# Altium schematic sheet 06_LMS7002M_RF2.SchDoc: LMS7002M RF
size A3; Organization: Lime Microsystems; Address1: Surrey Tech Centre; Address2: Guildford GU2 7YG; Address3: Surrey; Address4: United Kingdom; Revision: v1.2; SheetNumber: 6; SheetTotal: 16
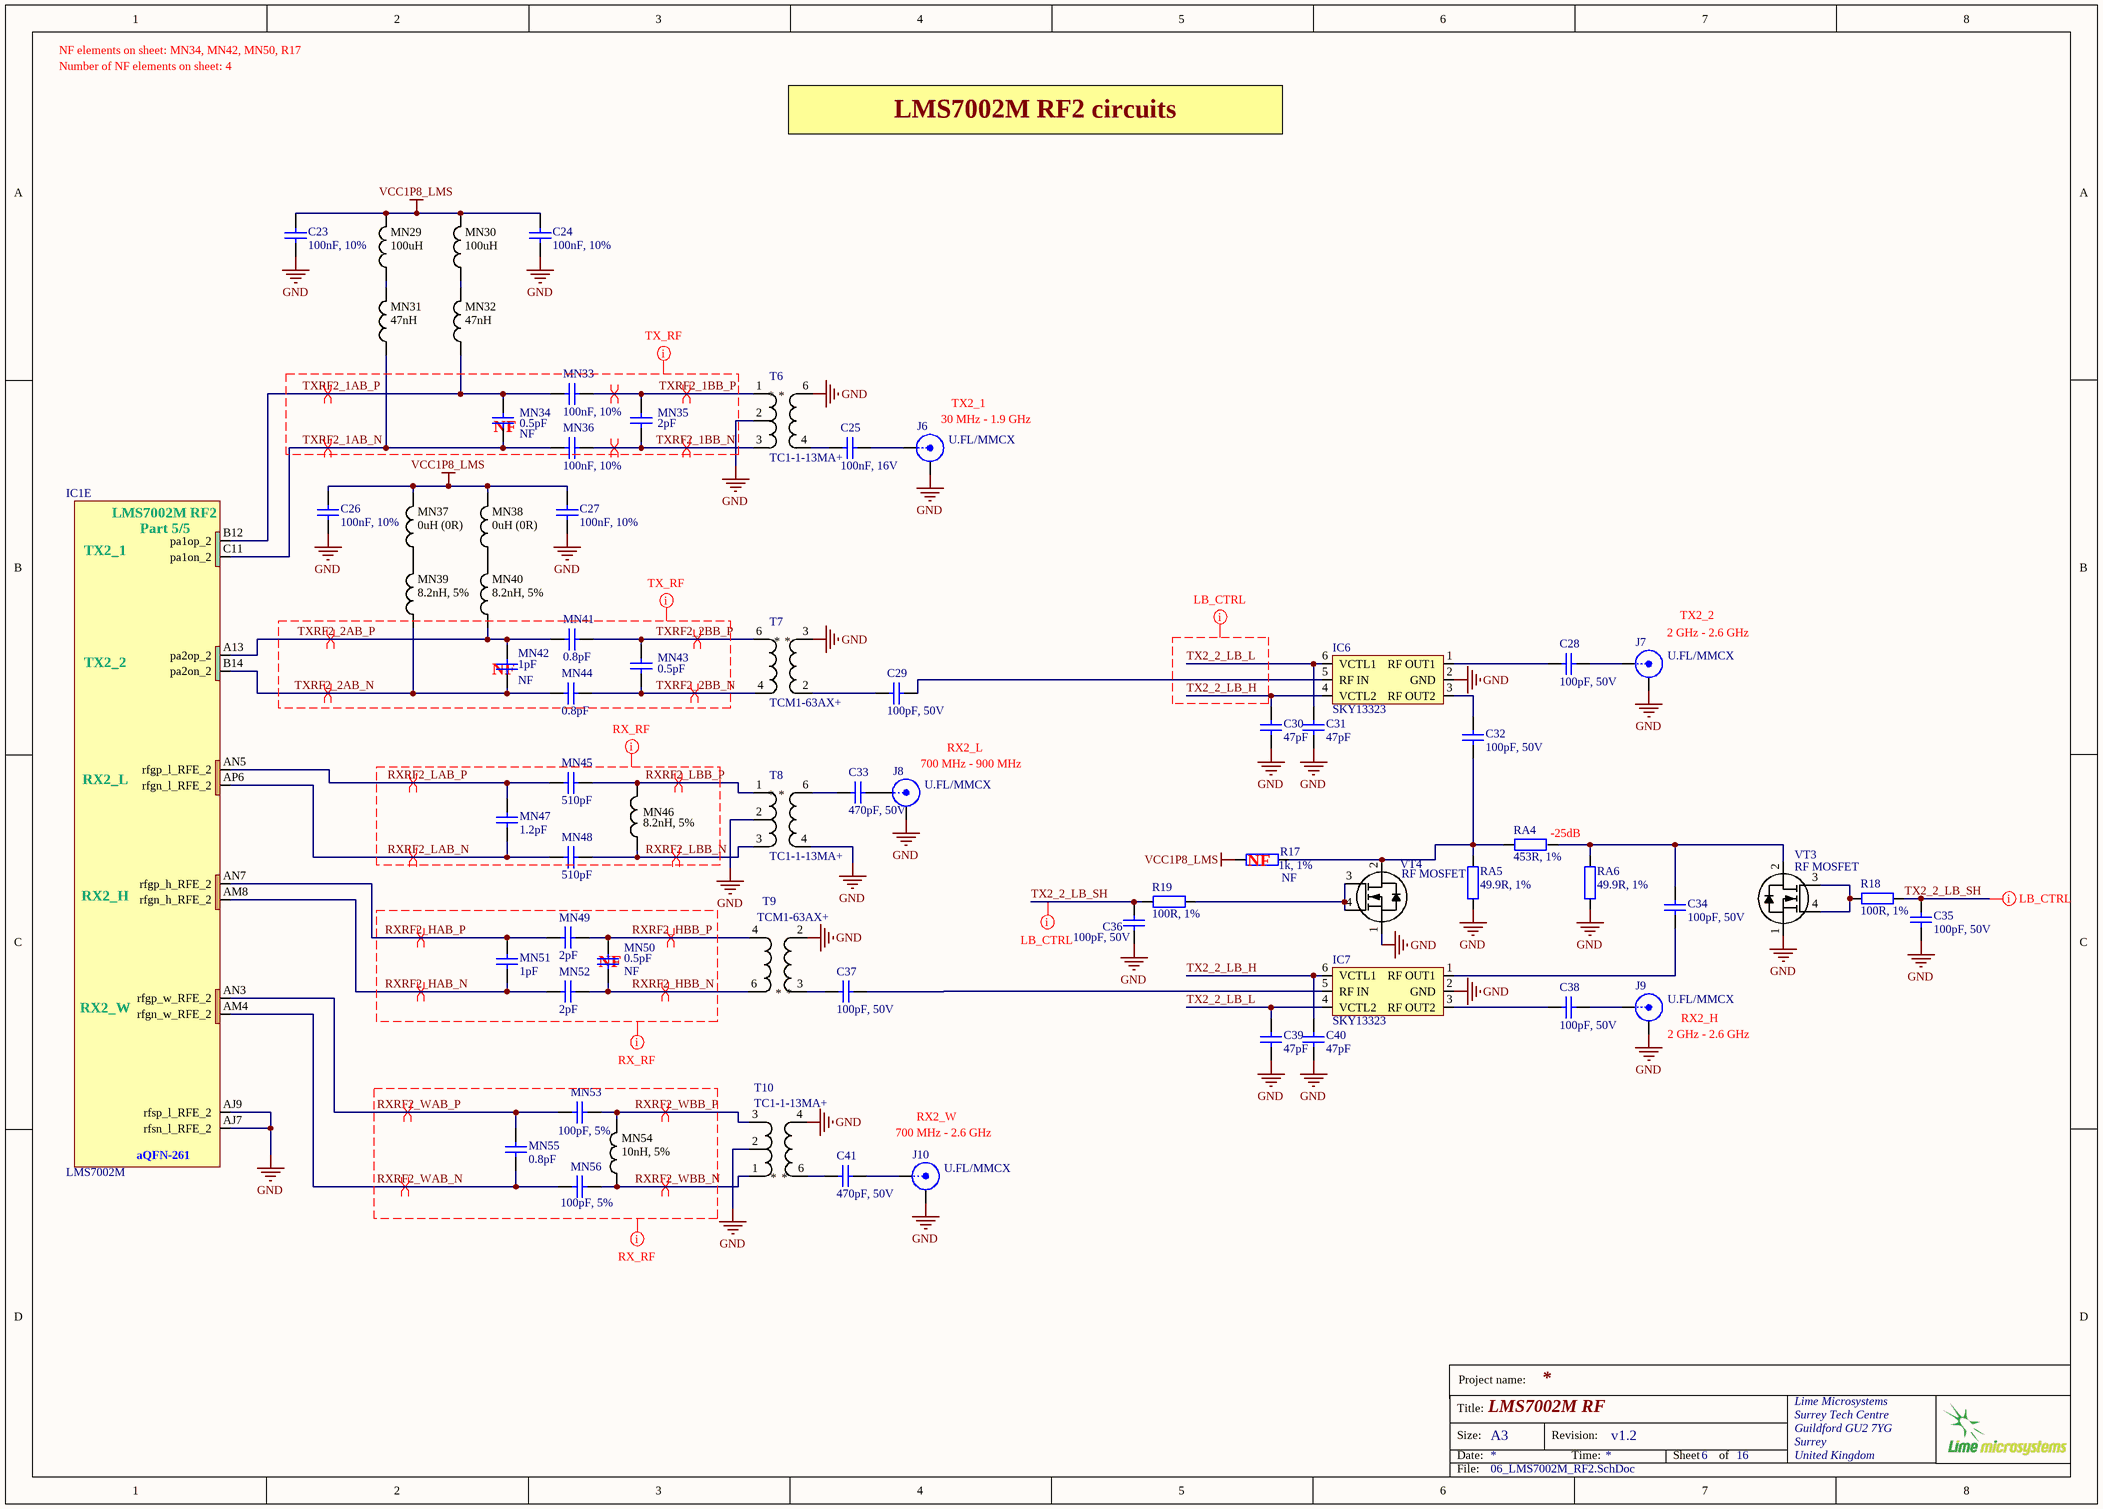
[diagram p0: 06_LMS7002M_RF2.SchDoc]

## Parts
C23  100nF, 10%  [CAP0402]
C24  100nF, 10%  [CAP0402]
C25  100nF, 16V  [CAP0402]
C26  100nF, 10%  [CAP0402]
C27  100nF, 10%  [CAP0402]
C28  100pF, 50V  [CAP0402]
C29  100pF, 50V  [CAP0402]
C30  47pF  [CAP0402]
C31  47pF  [CAP0402]
C32  100pF, 50V  [CAP0402]
C33  470pF, 50V  [CAP0402]
C34  100pF, 50V  [CAP0402]
C35  100pF, 50V  [CAP0402]
C36  100pF, 50V  [CAP0402]
C37  100pF, 50V  [CAP0402]
C38  100pF, 50V  [CAP0402]
C39  47pF  [CAP0402]
C40  47pF  [CAP0402]
C41  470pF, 50V  [CAP0402]
IC1  LMS7002M  [LMS7002M_v2]  (part E of 5)
IC6  SKY13323  [SKY13323-378LF]
IC7  SKY13323  [SKY13323-378LF]
J6  U.FL/MMCX  [MMCX_UFL_conn_u]
J7  U.FL/MMCX  [MMCX_UFL_conn_u]
J8  U.FL/MMCX  [MMCX_UFL_conn_u]
J9  U.FL/MMCX  [MMCX_UFL_conn_u]
J10  U.FL/MMCX  [MMCX_UFL_conn_u]
MN29  100uH  [RES0805]
MN30  100uH  [RES0805]
MN31  47nH  [RES0402]
MN32  47nH  [RES0402]
MN33  100nF, 10%  [CAP0402]
MN34  0.5pF  Assembly Info: NF  [CAP0402]
MN35  2pF  [CAP0402]
MN36  100nF, 10%  [CAP0402]
MN37  0uH (0R)  [RES0805]
MN38  0uH (0R)  [RES0805]
MN39  8.2nH, 5%  [RES0402]
MN40  8.2nH, 5%  [RES0402]
MN41  0.8pF  [CAP0402]
MN42  1pF  Assembly Info: NF  [CAP0402]
MN43  0.5pF  [CAP0402]
MN44  0.8pF  [CAP0402]
MN45  510pF  [CAP0402]
MN46  8.2nH, 5%  [RES0402]
MN47  1.2pF  [CAP0402]
MN48  510pF  [CAP0402]
MN49  2pF  [CAP0402]
MN50  0.5pF  Assembly Info: NF  [CAP0402]
MN51  1pF  [CAP0402]
MN52  2pF  [CAP0402]
MN53  100pF, 5%  [CAP0402]
MN54  10nH, 5%  [RES0402]
MN55  0.8pF  [CAP0402]
MN56  100pF, 5%  [CAP0402]
R17  1k, 1%  Assembly Info: NF  [RES0402]
R18  100R, 1%  [RES0402]
R19  100R, 1%  [RES0402]
RA4  453R, 1%  [RES0402]
RA5  49.9R, 1%  [RES0402]
RA6  49.9R, 1%  [RES0402]
T6  TC1-1-13MA+  [TC1-1-13MA+_v2]
T7  TCM1-63AX+  [TCM1-63AX+_v2]
T8  TC1-1-13MA+  [TC1-1-13MA+_v2]
T9  TCM1-63AX+  [TCM1-63AX+_v2]
T10  TC1-1-13MA+  [TC1-1-13MA+_v2]
VT3  RF MOSFET  [BF1105R_SOT143R4]
VT4  RF MOSFET  [BF1105R_SOT143R4]

## Nets
GND: C23.1 C24.1 C26.1 C27.1 C30.1 C31.1 C35.2 C36.2 C39.1 C40.1 IC1.AJ7(rfsn_l_RFE_2) IC1.AJ9(rfsp_l_RFE_2) IC6.2(GND) IC7.2(GND) J6.2(Y) J7.2(Y) J8.2(Y) J9.2(Y) J10.2(Y) RA5.1 RA6.1 T6.2 T6.6 T7.3 T8.2 T8.4 T9.2 T10.2 T10.4 VT3.1(S) VT4.1(S)
VCC1P8_LMS: C23.2 C24.2 C26.2 C27.2 MN29.2 MN30.2 MN37.2 MN38.2 R17.2
RXRF2_HAB_N: IC1.AM8(rfgn_h_RFE_2) MN51.1 MN52.2
RXRF2_HAB_P: IC1.AN7(rfgp_h_RFE_2) MN49.2 MN51.2
RXRF2_HBB_N: MN50.1 MN52.1 T9.6
RXRF2_HBB_P: MN49.1 MN50.2 T9.4
RXRF2_LAB_N: IC1.AP6(rfgn_l_RFE_2) MN47.1 MN48.2
RXRF2_LAB_P: IC1.AN5(rfgp_l_RFE_2) MN45.2 MN47.2
RXRF2_LBB_N: MN46.1 MN48.1 T8.3
RXRF2_LBB_P: MN45.1 MN46.2 T8.1
RXRF2_WAB_N: IC1.AM4(rfgn_w_RFE_2) MN55.2 MN56.2
RXRF2_WAB_P: IC1.AN3(rfgp_w_RFE_2) MN53.2 MN55.1
RXRF2_WBB_N: MN54.1 MN56.1 T10.1
RXRF2_WBB_P: MN53.1 MN54.2 T10.3
TX2_2_LB_H: C30.2 C40.2 IC6.4(VCTL2) IC7.6(VCTL1)
TX2_2_LB_L: C31.2 C39.2 IC6.6(VCTL1) IC7.4(VCTL2)
TX2_2_LB_SH: C35.1 C36.1 R18.1 R19.2
TXRF2_1AB_N: IC1.C11(pa1on_2) MN31.1 MN34.1 MN36.1
TXRF2_1AB_P: IC1.B12(pa1op_2) MN32.1 MN33.2 MN34.2
TXRF2_1BB_N: MN35.1 MN36.2 T6.3
TXRF2_1BB_P: MN33.1 MN35.2 T6.1
TXRF2_2AB_N: IC1.B14(pa2on_2) MN39.1 MN42.2 MN44.2
TXRF2_2AB_P: IC1.A13(pa2op_2) MN40.1 MN41.2 MN42.1
TXRF2_2BB_N: MN43.1 MN44.1 T7.4
TXRF2_2BB_P: MN41.1 MN43.2 T7.6
NetC25_1: C25.1 J6.1(X)
NetC25_2: C25.2 T6.4
NetC28_1: C28.1 J7.1(X)
NetC28_2: C28.2 IC6.1(RF_OUT1)
NetC29_1: C29.1 IC6.5(RF_IN)
NetC29_2: C29.2 T7.2
NetC32_1: C32.1 IC6.3(RF_OUT2)
NetC32_2: C32.2 R17.1 RA4.1 RA5.2 VT4.2(D)
NetC33_1: C33.1 J8.1(X)
NetC33_2: C33.2 T8.6
NetC34_1: C34.1 RA4.2 RA6.2 VT3.2(D)
NetC34_2: C34.2 IC7.1(RF_OUT1)
NetC37_1: C37.1 IC7.5(RF_IN)
NetC37_2: C37.2 T9.3
NetC38_1: C38.1 J9.1(X)
NetC38_2: C38.2 IC7.3(RF_OUT2)
NetC41_1: C41.1 J10.1(X)
NetC41_2: C41.2 T10.6
NetMN29_1: MN29.1 MN31.2
NetMN30_1: MN30.1 MN32.2
NetMN37_1: MN37.1 MN39.2
NetMN38_1: MN38.1 MN40.2
NetR18_2: R18.2 VT3.3(G2) VT3.4(G1)
NetR19_1: R19.1 VT4.3(G2) VT4.4(G1)

## Layout directives
differential pair: RXRF2_HAB_N, RXRF2_HAB_P, RXRF2_HBB_N, RXRF2_HBB_P, RXRF2_LAB_N, RXRF2_LAB_P, RXRF2_LBB_N, RXRF2_LBB_P, RXRF2_WAB_N, RXRF2_WAB_P, RXRF2_WBB_N, RXRF2_WBB_P, TXRF2_1AB_N, TXRF2_1AB_P, TXRF2_1BB_N, TXRF2_1BB_P, TXRF2_2AB_N, TXRF2_2AB_P, TXRF2_2BB_N, TXRF2_2BB_P
net class TX_RF: TXRF2_1AB_N, TXRF2_1AB_P, TXRF2_1BB_N, TXRF2_1BB_P, TXRF2_2AB_N, TXRF2_2AB_P, TXRF2_2BB_N, TXRF2_2BB_P
net class RX_RF: RXRF2_HAB_N, RXRF2_HAB_P, RXRF2_HBB_N, RXRF2_HBB_P, RXRF2_LAB_N, RXRF2_LAB_P, RXRF2_LBB_N, RXRF2_LBB_P, RXRF2_WAB_N, RXRF2_WAB_P, RXRF2_WBB_N, RXRF2_WBB_P
net class LB_CTRL: TX2_2_LB_H, TX2_2_LB_L, TX2_2_LB_SH

## Notes on the sheet
- Number of NF elements on sheet: 4
- NF elements on sheet: MN34, MN42, MN50, R17
- LMS7002M RF2 circuits
- (near MN34) NF
- (near J6) 30 MHz - 1.9 GHz
- (near J6) TX2_1
- (near J7) 2 GHz - 2.6 GHz
- (near J7) TX2_2
- (near MN42) NF
- (near J8) 700 MHz - 900 MHz
- RX2_L
- (near RA4) -25dB
- (near R17) NF
- (near MN50) NF
- (near J9) 2 GHz - 2.6 GHz
- (near J9) RX2_H
- (near J10) RX2_W
- 700 MHz - 2.6 GHz
- Project name:
- Title:
- Size:
- Date:
- A3
- Revision:
- Time:
- Sheet
- of
- File:
- (in symbol LMS7002M, part E) LMS7002M RF2; Part 5/5; TX2_1; TX2_2; RX2_L; RX2_H; RX2_W; aQFN-261

## Library data of the parts
C23 C24 C26 C27 = Cap_0402: Manufacturer: Murata Electronics; Manufacturer Part Number: GRM155R71C104KA88D; Part Description: 0.10µF ±10% 16V X7R Ceramic Capacitor -55°C ~ 125°C Surface Mount, MLCC 0402 (1005 Metric) 0.039" L x 0.020" W (1.00mm x 0.50mm); Voltage Rating DC: 16 V; Type: General Purpose MLCC; Capacitance: 0.1 uF; Case Length: 1 mm; Dielectric: X7R; Case Height: 0.5 mm; Temperature Coefficient / Code: +/- 15 %; Value: 100nF, 10%; Supplier 1: Mouser; Supplier Part Number 1: 81-GRM155R71C104KA88; Case Code - in: 0402; RoHS: RoHS Compliant; Operating Temperature Range: - 55 C to + 125 C; Series: GRM; Termination Style: SMD/SMT; Tolerance: 10 %; Package / Case: 0402 (1005 metric); Maximum Operating Temperature: + 125 C; Case Code - mm: 1005; Minimum Operating Temperature: - 55 C; Product Category: Low & Medium Capacitance SMD Ceramic Chip Capacitors; Packaging: Reel; Product: General Type MLCCs; Category: Multilayer Ceramic Capacitors MLCC - SMD/SMT; Brand: Murata Electronics; Case Width: 0.5 mm; RoHS - Mouser: Y; Standard Pack Qty: 10000; Minimum Order Quantity: 1; Reeling: True; Manufacturer Part Number 1: GRM155R71C104KA88D
C25 = Cap_0402: Manufacturer: Murata Electronics; Manufacturer Part Number: GRM155R71C104KA88D; Part Description: 0.10µF ±10% 16V X7R Ceramic Capacitor -55°C ~ 125°C Surface Mount, MLCC 0402 (1005 Metric) 0.039" L x 0.020" W (1.00mm x 0.50mm); Tolerance: 10 %; Type: General Purpose MLCC; Capacitance: 0.1 uF; Case Length: 1 mm; Dielectric: X7R; Case Height: 0.5 mm; Temperature Coefficient / Code: +/- 15 %; Value: 100nF, 16V; Supplier 1: Mouser; Supplier Part Number 1: 81-GRM155R71C104KA88; Case Code - in: 0402; RoHS: RoHS Compliant; Operating Temperature Range: - 55 C to + 125 C; Series: GRM; Termination Style: SMD/SMT; Package / Case: 0402 (1005 metric); Voltage Rating DC: 16 V; Maximum Operating Temperature: + 125 C; Case Code - mm: 1005; Minimum Operating Temperature: - 55 C; Product Category: Low & Medium Capacitance SMD Ceramic Chip Capacitors; Packaging: Reel; Product: General Type MLCCs; Category: Multilayer Ceramic Capacitors MLCC - SMD/SMT; Brand: Murata Electronics; Case Width: 0.5 mm; RoHS - Mouser: Y; Standard Pack Qty: 10000; Minimum Order Quantity: 1; Reeling: True; Manufacturer Part Number 1: GRM155R71C104KA88D
C28 C29 C32 C34-C38 = Cap_0402: Manufacturer Part Number 1: CC0402JRNPO9BN101; Manufacturer: Yageo; Part Description: 100pF ±5% 50V C0G, NP0 Ceramic Capacitor -55°C ~ 125°C Surface Mount, MLCC 0402 (1005 Metric) 0.039" L x 0.020" W (1.00mm x 0.50mm); Tolerance: ±5%; Temperature Coefficient: C0G, NP0; Value: 100pF, 50V; Capacitance: 100pF; Thickness (Max): 0.022" (0.55mm); Size / Dimension: 0.039" L x 0.020" W (1.00mm x 0.50mm); RoHS: RoHS Compliant; Ratings: -; Package / Case: 0402 (1005 Metric); Mounting Type: Surface Mount, MLCC; Height - Seated (Max): -; Features: -; Lead Spacing: -; Voltage - Rated: 50V; Operating Temperature: -55°C ~ 125°C; Packaging: Cut Tape (CT); Applications: General Purpose; Lead Style: -; Supplier 1: Digi-Key; Category: Capacitors; Supplier Part Number 1: 311-1024-1-ND
C30 C31 C39 C40 = Cap_0402: Manufacturer Part Number 1: C1005C0G1H470F050BA; Manufacturer: TDK Corporation; Part Description: 47pF ±1% 50V C0G, NP0 Ceramic Capacitor -55°C ~ 125°C Surface Mount, MLCC 0402 (1005 Metric) 0.039" L x 0.020" W (1.00mm x 0.50mm); Voltage - Rated: 50V; Temperature Coefficient: C0G, NP0; Tolerance: ±1%; Value: 47pF; Supplier 1: Digi-Key; Supplier Part Number 1: 445-5361-1-ND; Package / Case: 0402 (1005 Metric); Lead Spacing: -; Ratings: -; Mounting Type: Surface Mount, MLCC; Operating Temperature: -55°C ~ 125°C; Thickness (Max): 0.022" (0.55mm); Capacitance: 47pF; Packaging: Cut Tape (CT); Features: -; Applications: General Purpose; Lead Style: -; Size / Dimension: 0.039" L x 0.020" W (1.00mm x 0.50mm); Height - Seated (Max): -; RoHS: RoHS Compliant; Category: Capacitors
C33 C41 = Cap_0402: Manufacturer Part Number: C1005C0G1H471J050BA; Manufacturer: TDK Corporation; Part Description: 470pF ±5% 50V C0G, NP0 Ceramic Capacitor -55°C ~ 125°C Surface Mount, MLCC 0402 (1005 Metric) 0.039" L x 0.020" W (1.00mm x 0.50mm); Tolerance: ±5%; Temperature Coefficient: C0G, NP0; Value: 470pF, 50V; Supplier 1: Digi-Key; Supplier Part Number 1: 445-2656-6-ND; Ratings: -; Package / Case: 0402 (1005 Metric); Capacitance: 470pF; Packaging: Digi-Reel®; RoHS: RoHS Compliant; Lead Style: -; Thickness (Max): 0.022" (0.55mm); Size / Dimension: 0.039" L x 0.020" W (1.00mm x 0.50mm); Lead Spacing: -; Operating Temperature: -55°C ~ 125°C; Height - Seated (Max): -; Applications: General Purpose; Mounting Type: Surface Mount, MLCC; Voltage - Rated: 50V; Category: Capacitors; Features: -
IC1 = LMS7002M: Part Description: IC FPRF Transceiver LMS7002M; 261 pin aQFN; Manufacturer: Lime Microsystems; Manufacturer Part Number 1: LMS7002M; Supplier 1: Lime Microsystems; Supplier Part Number 1: LMS7002M
IC6 IC7 = SKY13323: SKY13323-378LF: 0.1-3.0 GHz GaAs SPDT Switch; Manufacturer: Skyworks Solutions Inc.; Part Description: IC SPDT 100MHZ-3GHZ 6-MLPD; Frequency - Lower: 100MHz; P1dB: 27dBm (typ) IP1dB; Isolation @ Frequency: 27dB @ 3GHz (typ); RF Type: 802.11b/g; Impedance: 50 Ohm; IIP3: 50dBm (typ); Topology: Reflective; Insertion Loss @ Frequency: 0.35dB @ 3GHz; Frequency - Upper: 3GHz; Supplier 1: Digi-Key; Operating Temperature: -40°C ~ 85°C; RoHS: RoHS Compliant; Package / Case: 6-XFDFN Exposed Pad; Circuit: SPDT; Features: -; Supplier Device Package: 6-MLPD (1x1); Category: RF/IF and RFID; Packaging: Cut Tape (CT); Manufacturer Part Number 1: SKY13323-378LF; Supplier Part Number 1: 683-1334-1-ND
J6-J10 = RF_IF_connector: CONN UMC RCPT STR 50 OHM SMD; Manufacturer: Molex, LLC; Manufacturer Part Number 1: 0734120110; Body Finish: Nickel; Body Material: Phosphor Bronze; Center Contact Material: Brass; Center Contact Plating: Gold; Connector Style: Ultra Miniature Coaxial; Connector Type: Jack, Male Pin; Contact Termination: Solder; Dielectric Material: Liquid Crystal Polymer (LCP); Frequency - Max: 6GHz; Impedance: 50 Ohm; Voltage Rating: 60V; Cable Group: -; Category: Connectors, Interconnects; Fastening Type: Snap-On; Features: -; Housing Color: Silver; Ingress Protection: -; Mounting Type: Surface Mount; Operating Temperature: -40°C ~ 90°C; Packaging: Cut Tape (CT); RoHS: RoHS Compliant; Shield Termination: Solder; Supplier 1: Digi-Key; Supplier Part Number 1: WM5587CT-ND; Part Description: CONN UMC RCPT STR 50 OHM SMD
MN29 MN30 = Inductor_0603: Manufacturer: TDK Corporation; Manufacturer Part Number: MLF2012C101KT000; Part Description: FIXED IND 100UH 2MA 3.1 OHM SMD; Q @ Freq: 25 @ 1MHz; Shielding: Shielded; Current Rating: 2mA; Frequency - Self Resonant: 7MHz; Frequency - Test: 1MHz; Material - Core: Ferrite; Tolerance: ±10%; Inductance: 100µH; DC Resistance (DCR): 3.1 Ohm Max; Value: 100uH; Supplier 1: Digi-Key; Supplier Part Number 1: 445-1071-1-ND; Supplier Device Package: 0805 (2012 Metric); Size / Dimension: 0.079" L x 0.049" W (2.00mm x 1.25mm); Operating Temperature: -40°C ~ 85°C; Packaging: Cut Tape (CT); RoHS: RoHS Compliant; Current - Saturation: -; Height - Seated (Max): 0.057" (1.45mm); Package / Case: 0805 (2012 Metric); Mounting Type: Surface Mount; Type: Multilayer; Category: Inductors, Coils, Chokes
MN31 MN32 = Inductor_0603: Manufacturer: COILCRAFT; Manufacturer Part Number: 0402HP-47NXJLU; Part Description: Surface Mount High Frequency Inductor, 0402HP Series, 47 nH, ± 5%, 0402 [1005 Metric], 2.4 GHz; SVHC: No SVHC (15-Jun-2015); Inductance Tolerance: ± 5%; High Frequency Inductor Case: 0402 [1005 Metric]; Inductor Case Style: 0402 [1005 Metric]<!--FANDB--><div class="features-and-benefits-container"></div>; Inductance: 47; DC Resistance Max: 0.58; Self Resonant Frequency Min: 2.4; Product Range: 0402; DC Current Rating: 420; Inductor Construction: Wirewound; Supplier 1: Farnell; Supplier Part Number 1: 2285856; Packaging: Cut Tape; RoHS: Y-EX; value: 47nH
MN33 MN36 = Cap_0402: Manufacturer: Murata Electronics; Manufacturer Part Number: GRM155R71C104KA88D; Part Description: 0.10µF ±10% 16V X7R Ceramic Capacitor -55°C ~ 125°C Surface Mount, MLCC 0402 (1005 Metric) 0.039" L x 0.020" W (1.00mm x 0.50mm); Voltage Rating DC: 16 V; Capacitance: 0.1 uF; Case Length: 1 mm; Dielectric: X7R; Case Height: 0.5 mm; Temperature Coefficient / Code: +/- 15 %; Value: 100nF, 10%; Supplier 1: Mouser; Supplier Part Number 1: 81-GRM155R71C104KA88; Case Code - in: 0402; RoHS: RoHS Compliant; Operating Temperature Range: - 55 C to + 125 C; Series: GRM; Termination Style: SMD/SMT; Tolerance: 10 %; Package / Case: 0402 (1005 metric); Type: General Purpose MLCC; Maximum Operating Temperature: + 125 C; Case Code - mm: 1005; Minimum Operating Temperature: - 55 C; Product Category: Low & Medium Capacitance SMD Ceramic Chip Capacitors; Packaging: Reel; Product: General Type MLCCs; Category: Multilayer Ceramic Capacitors MLCC - SMD/SMT; Brand: Murata Electronics; Case Width: 0.5 mm; RoHS - Mouser: Y; Standard Pack Qty: 10000; Minimum Order Quantity: 1; Reeling: True; Manufacturer Part Number 1: GRM155R71C104KA88D
MN34 MN43 MN50 = Cap_0402: Manufacturer: Yageo; Manufacturer Part Number 1: CC0402CRNPO9BNR50; Part Description: 0.50pF ±0.25pF 50V C0G, NP0 Ceramic Capacitor -55°C ~ 125°C Surface Mount, MLCC 0402 (1005 Metric) 0.039" L x 0.020" W (1.00mm x 0.50mm); Capacitance: 0.50pF; Voltage - Rated: 50V; Temperature Coefficient: C0G, NP0; Tolerance: ±0.25pF; Value: 0.5pF; Supplier 1: Digi-Key; Supplier Part Number 1: 311-1001-1-ND; RoHS: RoHS Compliant; Thickness (Max): 0.022" (0.55mm); Features: -; Height - Seated (Max): -; Lead Spacing: -; Applications: General Purpose; Packaging: Cut Tape (CT); Ratings: -; Size / Dimension: 0.039" L x 0.020" W (1.00mm x 0.50mm); Lead Style: -; Mounting Type: Surface Mount, MLCC; Operating Temperature: -55°C ~ 125°C; Package / Case: 0402 (1005 Metric); Category: Capacitors
MN35 MN49 MN52 = Cap_0402: Manufacturer Part Number: 04025U2R0BAT2A; Manufacturer: AVX; Part Description: SMD Multilayer Ceramic Capacitor, U Series, 2 pF, ± 0.1pF, C0G / NP0, 50 V, 0402 [1005 Metric]; Product Range: U Series; Voltage Rating: 50; SVHC: No SVHC (17-Dec-2014); Capacitance Tolerance: ± 0.1; Ceramic Capacitor Case: 0402 [1005 Metric]; Capacitance: 2; Dielectric Characteristic: C0G / NP0; Value: 2pF; Supplier 1: Farnell; Supplier Part Number 1: 2332536; Operating Temperature Max: 125; RoHS: YES; Operating Temperature Min: -55; Capacitance Tolerance ±: ± 0.1; Packaging: Cut Tape; MSL: MSL 1 - Unlimited
MN37 MN38 = Inductor_0603: Manufacturer: BOURNS; Manufacturer Part Number: CR0805-J/-000ELF; Part Description: Surface Mount Chip Resistor, Thick Film, CR Series, 0 ohm, 125 mW, ± 5%, 150 V, 0805 [2012 Metric]; Value: 0uH (0R); Supplier 1: Farnell; Supplier Part Number 1: 2008388; RoHS: YES
MN39 MN40 MN46 = Inductor_0603: Manufacturer: COILCRAFT; Manufacturer Part Number 1: 0402HP-8N2XJLU; Part Description: Surface Mount High Frequency Inductor, 0402HP Series, 8.2 nH, ± 5%, 0402 [1005 Metric], 5.4 GHz; Inductor Construction: Wirewound; DC Current Rating: 1.5; Inductor Case Style: 0402 [1005 Metric]<!--FANDB--><div class="features-and-benefits-container"></div>; Self Resonant Frequency Min: 5.4; DC Resistance Max: 0.065; High Frequency Inductor Case: 0402 [1005 Metric]; SVHC: No SVHC (16-Jun-2014); Inductance: 8.2; Supplier 1: Farnell; Supplier Part Number 1: 2285826; Packaging: Cut Tape; Product Range: COILCRAFT - 0402; Inductance Tolerance: ± 5%; RoHS: Y-EX; Value: 8.2nH, 5%
MN41 MN44 MN55 = Cap_0402: Manufacturer: Murata Electronics North America; Manufacturer Part Number: GRM1555C1HR80BA01D; Part Description: 0.80pF ±0.1pF 50V C0G, NP0 Ceramic Capacitor -55°C ~ 125°C Surface Mount, MLCC 0402 (1005 Metric) 0.039" L x 0.020" W (1.00mm x 0.50mm); Temperature Coefficient: C0G, NP0; Capacitance: 0.80pF; Voltage - Rated: 50V; Tolerance: ±0.1pF; Value: 0.8pF; Applications: General Purpose; Operating Temperature: -55°C ~ 125°C; Size / Dimension: 0.039" L x 0.020" W (1.00mm x 0.50mm); Features: -; Supplier 1: Digi-Key; Height - Seated (Max): -; Category: Capacitors; Package / Case: 0402 (1005 Metric); Mounting Type: Surface Mount, MLCC; Lead Spacing: -; Thickness (Max): 0.022" (0.55mm); RoHS: RoHS Compliant; Supplier Part Number 1: 490-6269-1-ND; Packaging: Cut Tape (CT); Ratings: -; Lead Style: -
MN42 MN51 = Cap_0402: Manufacturer: TDK Corporation; Manufacturer Part Number 1: C1005C0G1H010B050BA; Part Description: 1pF ±0.1pF 50V C0G, NP0 Ceramic Capacitor -55°C ~ 125°C Surface Mount, MLCC 0402 (1005 Metric) 0.039" L x 0.020" W (1.00mm x 0.50mm); Voltage - Rated: 50V; Temperature Coefficient: C0G, NP0; Tolerance: ±0.1pF; Value: 1pF; Supplier 1: Digi-Key; Supplier Part Number 1: 445-4854-6-ND; Size / Dimension: 0.039" L x 0.020" W (1.00mm x 0.50mm); Lead Spacing: -; Operating Temperature: -55°C ~ 125°C; Thickness (Max): 0.022" (0.55mm); Package / Case: 0402 (1005 Metric); Features: -; Lead Style: -; Applications: General Purpose; Height - Seated (Max): -; Capacitance: 1pF; RoHS: RoHS Compliant; Mounting Type: Surface Mount, MLCC; Packaging: Digi-Reel®; Ratings: -; Category: Capacitors
MN45 MN48 = Cap_0402: Manufacturer: Murata Electronics North America; Manufacturer Part Number: GRM1555C1H511JA01D; Part Description: 510pF ±5% 50V C0G, NP0 Ceramic Capacitor -55°C ~ 125°C Surface Mount, MLCC 0402 (1005 Metric) 0.039" L x 0.020" W (1.00mm x 0.50mm); Voltage - Rated: 50V; Temperature Coefficient: C0G, NP0; Tolerance: ±5%; Value: 510pF; Supplier 1: Digi-Key; Supplier Part Number 1: 490-3237-1-ND; Height - Seated (Max): -; Features: -; Size / Dimension: 0.039" L x 0.020" W (1.00mm x 0.50mm); Applications: General Purpose; Lead Spacing: -; Package / Case: 0402 (1005 Metric); Ratings: -; Thickness (Max): 0.022" (0.55mm); Lead Style: -; Operating Temperature: -55°C ~ 125°C; Mounting Type: Surface Mount, MLCC; Capacitance: 510pF; Category: Capacitors; RoHS: RoHS Compliant; Packaging: Cut Tape (CT)
MN47 = Cap_0402: Manufacturer: Murata Electronics North America; Manufacturer Part Number: GRM1555C1H1R2CA01D; Part Description: 1.2pF ±0.25pF 50V C0G, NP0 Ceramic Capacitor -55°C ~ 125°C Surface Mount, MLCC 0402 (1005 Metric) 0.039" L x 0.020" W (1.00mm x 0.50mm); Temperature Coefficient: C0G, NP0; Voltage - Rated: 50V; Tolerance: ±0.25pF; Value: 1.2pF; Supplier 1: Digi-Key; Supplier Part Number 1: 490-5927-1-ND; Lead Style: -; Category: Capacitors; Features: -; Packaging: Cut Tape (CT); Operating Temperature: -55°C ~ 125°C; Package / Case: 0402 (1005 Metric); Applications: General Purpose; Size / Dimension: 0.039" L x 0.020" W (1.00mm x 0.50mm); Lead Spacing: -; Ratings: -; Mounting Type: Surface Mount, MLCC; RoHS: RoHS Compliant; Height - Seated (Max): -; Thickness (Max): 0.022" (0.55mm); Capacitance: 1.2pF
MN53 MN56 = Cap_0402: Manufacturer Part Number 1: CC0402JRNPO9BN101; Manufacturer: Yageo; Part Description: 100pF ±5% 50V C0G, NP0 Ceramic Capacitor -55°C ~ 125°C Surface Mount, MLCC 0402 (1005 Metric) 0.039" L x 0.020" W (1.00mm x 0.50mm); Temperature Coefficient: C0G, NP0; Voltage - Rated: 50V; Value: 100pF, 5%; Capacitance: 100pF; Thickness (Max): 0.022" (0.55mm); Size / Dimension: 0.039" L x 0.020" W (1.00mm x 0.50mm); Tolerance: ±5%; RoHS: RoHS Compliant; Ratings: -; Package / Case: 0402 (1005 Metric); Mounting Type: Surface Mount, MLCC; Height - Seated (Max): -; Features: -; Lead Spacing: -; Operating Temperature: -55°C ~ 125°C; Packaging: Cut Tape (CT); Applications: General Purpose; Lead Style: -; Supplier 1: Digi-Key; Category: Capacitors; Supplier Part Number 1: 311-1024-1-ND
MN54 = Inductor_0603: Manufacturer Part Number 1: 0402HP-10NXJLU; Manufacturer: COILCRAFT; Part Description: Surface Mount High Frequency Inductor, 0402HP Series, 10 nH, ± 5%, 0402 [1005 Metric], 4.7 GHz; Value: 10nH, 5%; Supplier 1: Farnell; Supplier Part Number 1: 2285830; RoHS: Y-EX
R17 = Res_0402: Manufacturer: Stackpole Electronics Inc; Manufacturer Part Number 1: RMCF0402FT1K00; Part Description: RES SMD 1K OHM 1% 1/16W 0402; Temperature Coefficient: ±100ppm/°C; Power (Watts): 0.063W, 1/16W; Value: 1k, 1%; Supplier 1: Digi-Key; Supplier Part Number 1: RMCF0402FT1K00TR-ND; Resistance (Ohms): 1k; Packaging: Tape & Reel (TR); Category: Resistors; RoHS: RoHS Compliant; Tolerance: ±1%; Height: 0.016" (0.40mm); Number of Terminations: 2; Package / Case: 0402 (1005 Metric); Operating Temperature: -55°C ~ 155°C; Features: -; Composition: Thick Film; Supplier Device Package: 0402; Size / Dimension: 0.039" L x 0.020" W (1.00mm x 0.50mm)
R18 R19 = Res_0402: Manufacturer Part Number 1: RMCF0402FT100R; Part Description: RES SMD 100 OHM 1% 1/16W 0402; Manufacturer: Stackpole Electronics Inc.; Temperature Coefficient: ±100ppm/°C; Supplier 1: Digi-Key; Supplier Part Number 1: RMCF0402FT100RDKR-ND; Package / Case: 0402 (1005 Metric); Composition: Thick Film; Category: Resistors; Tolerance: ±1%; Value: 100R, 1%
RA4 = Res_0402: Manufacturer Part Number 1: RC0402FR-07453RL; Manufacturer: Yageo; Part Description: RES SMD 453 OHM 1% 1/16W 0402; Temperature Coefficient: ±100ppm/°C; Power (Watts): 0.063W, 1/16W; Resistance (Ohms): 453; Size / Dimension: 0.039" L x 0.020" W (1.00mm x 0.50mm); Height: 0.016" (0.40mm); Number of Terminations: 2; Failure Rate: -; Package / Case: 0402 (1005 Metric); Supplier Device Package: 0402; Supplier Part Number 1: YAG3165CT-ND; Supplier 1: Digi-Key; Part Status: Active; Category: Resistors; RoHS: RoHS Compliant; Packaging: Cut Tape (CT); Operating Temperature: -55°C ~ 155°C; Features: Moisture Resistant; Composition: Thick Film; Tolerance: ±1%; Value: 453R, 1%
RA5 RA6 = Res_0402: Manufacturer: Samsung Electro-Mechanics America, Inc.; Manufacturer Part Number: RC1005F49R9CS; Part Description: RES SMD 49.9 OHM 1% 1/16W 0402; Temperature Coefficient: ±100ppm/°C; Resistance (Ohms): 49.9; Power (Watts): 0.063W, 1/16W; Number of Terminations: 2; Size / Dimension: 0.039" L x 0.020" W (1.00mm x 0.50mm); Supplier Device Package: 0402 (1005 Metric); RoHS: RoHS Compliant; Supplier Part Number 1: 1276-3469-6-ND; Features: -; Packaging: Digi-Reel®; Tolerance: ±1%; Height: 0.016" (0.40mm); Category: Resistors; Composition: Thick Film; Package / Case: 0402 (1005 Metric); Supplier 1: Digi-Key; Operating Temperature: -55°C ~ 155°C; Value: 49.9R, 1%
T6 T8 T10 = Balun: Manufacturer: Mini-Circuits; Part Description: RF balun, TC1-1-13MA+; Manufacturer Part Number 1: TC1-1-13MA+; Supplier Part Number 1: TC1-1-13MA+; Supplier 1: Minicircuits
T7 T9 = Balun_v2: Manufacturer: Mini-circuits; Part Description: RF balun, TCM1-63AX+; Supplier Part Number 1: TCM1-63AX+; Manufacturer Part Number 1: TCM1-63AX+; Supplier 1: Minicircuits
VT3 VT4 = BF1105R,215: Manufacturer: NXP Semiconductors; Part Description: RF MOSFET Transistors Trans MOSFET N-CH 7V 0.03A 4pin(3+Tab); Voltage - Rated: 7V; Noise Figure: 1.7dB; Current Rating: 30mA; Gain: 20dB; Transistor Type: N-Channel Dual Gate; Frequency: 800MHz; Voltage - Test: 5V; Supplier 1: Digi-Key; RoHS: RoHS Compliant; Supplier Device Package: SOT-143R; Power - Output: -; Current - Test: -; Manufacturer Part Number 1: BF1105R,215; Packaging: Digi-Reel®; Package / Case: SOT-143R; Category: Discrete Semiconductor Products; Supplier Part Number 1: 568-12530-6-ND